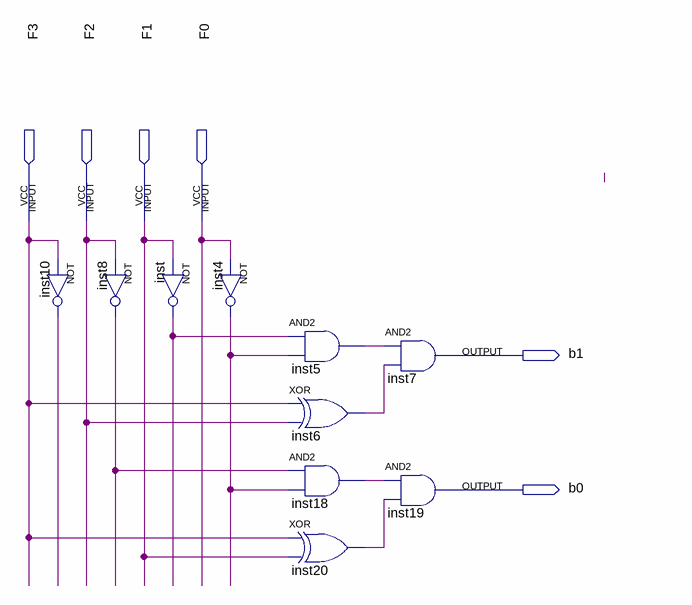
[diagram p0: schematic sheet]
// Quartus schematic ex1-2.bdf as structural Verilog: 10 symbols, 6 pins
module \ex1-2  (
  input  F3,
  input  F2,
  input  F1,
  input  F0,
  output b1,
  output b0
);

  wire inst4_out, inst5_out, inst6_out, inst8_out, inst10_out, inst18_out, inst20_out, inst_out;

  not inst8 (inst8_out, F2);
  not inst10 (inst10_out, F3);
  not inst (inst_out, F1);
  not inst4 (inst4_out, F0);
  and inst5 (inst5_out, inst_out, inst4_out);
  xor inst6 (inst6_out, F3, F2);
  and inst18 (inst18_out, inst8_out, inst4_out);
  xor inst20 (inst20_out, F3, F1);
  and inst7 (b1, inst5_out, inst6_out);
  and inst19 (b0, inst18_out, inst20_out);
endmodule
